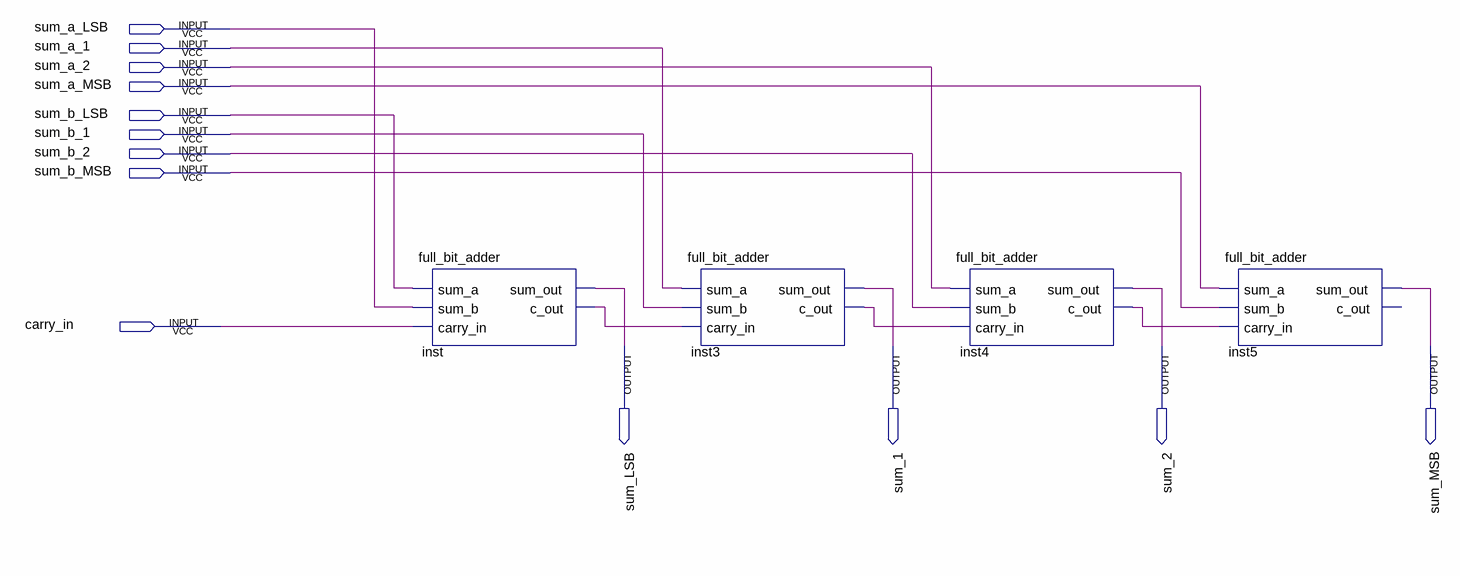
[diagram p0: schematic sheet]
// Quartus schematic 4bit_adder.bdf as structural Verilog: 4 symbols, 13 pins
module \4bit_adder  (
  input  sum_a_LSB,
  input  sum_a_1,
  input  sum_a_2,
  input  sum_a_MSB,
  input  sum_b_LSB,
  input  sum_b_1,
  input  sum_b_2,
  input  sum_b_MSB,
  input  carry_in,
  output sum_LSB,
  output sum_1,
  output sum_2,
  output sum_MSB
);

  wire inst3_c_out, inst4_c_out, inst_c_out;

  full_bit_adder inst (
    .sum_a(sum_b_LSB), .sum_b(sum_a_LSB), .carry_in(carry_in), .sum_out(sum_LSB), .c_out(inst_c_out));
  full_bit_adder inst3 (.sum_a(sum_a_1), .sum_b(sum_b_1), .carry_in(inst_c_out), .sum_out(sum_1), .c_out(inst3_c_out));
  full_bit_adder inst4 (.sum_a(sum_a_2), .sum_b(sum_b_2), .carry_in(inst3_c_out), .sum_out(sum_2), .c_out(inst4_c_out));
  full_bit_adder inst5 (
    .sum_a(sum_a_MSB), .sum_b(sum_b_MSB), .carry_in(inst4_c_out), .sum_out(sum_MSB));  // open: c_out
endmodule
